# EAGLE schematic DAq2017 (EAGLE 7.4.0)
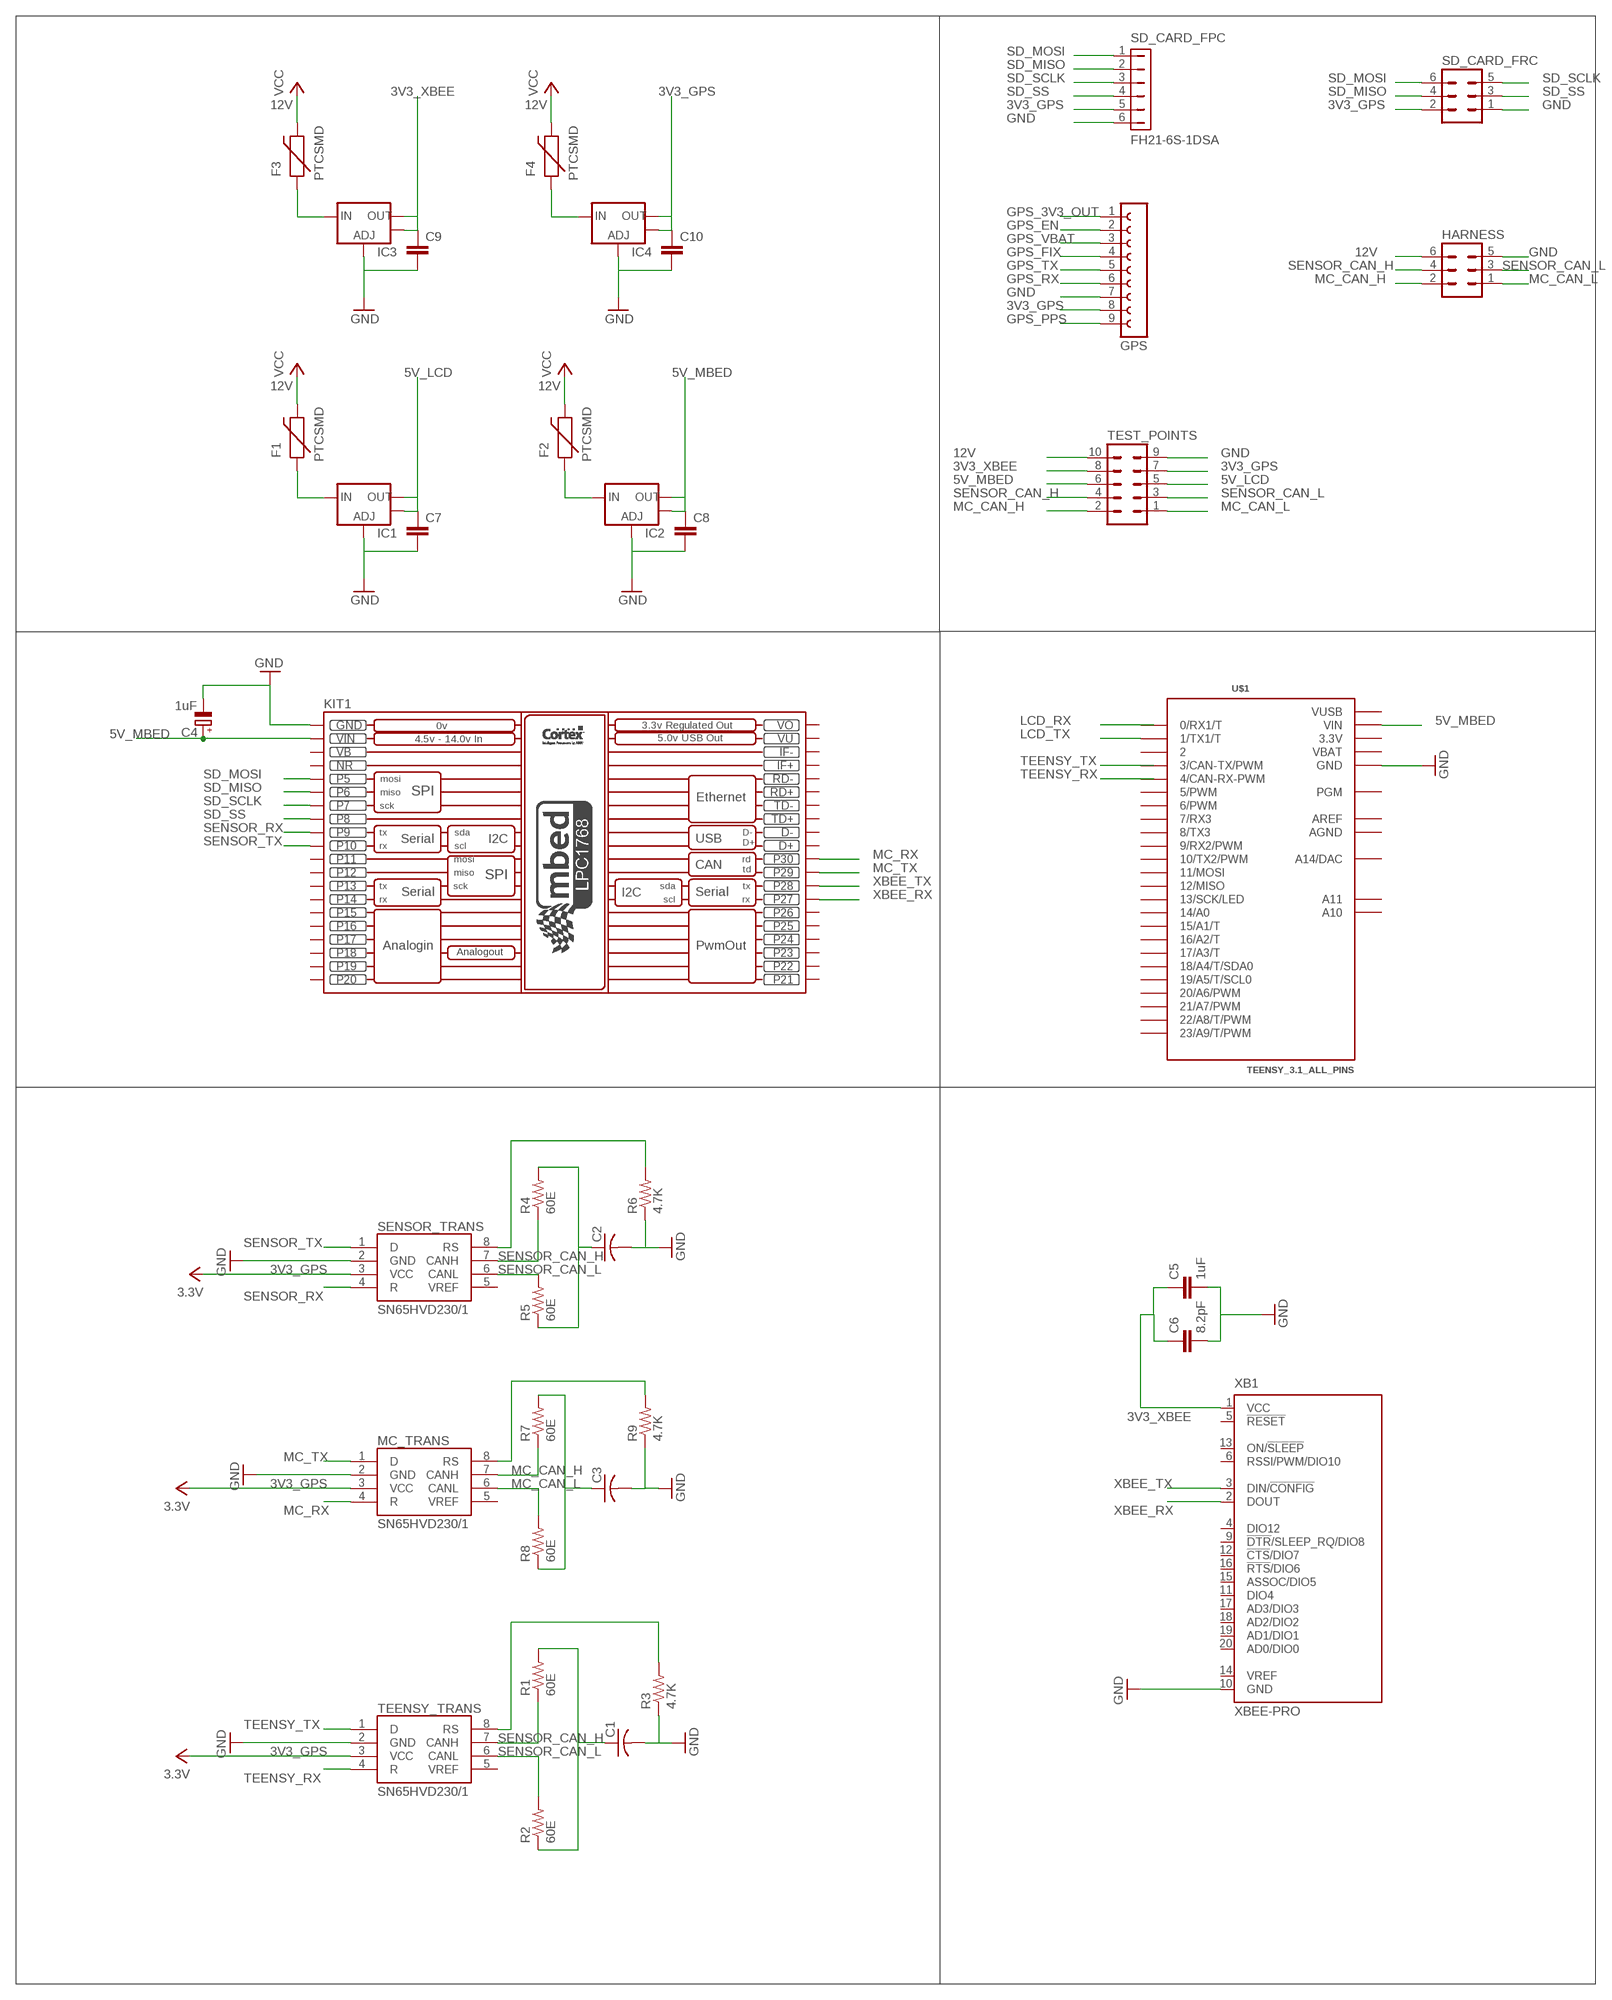
[diagram p0: schematic, sheet 1]

## Parts
C1  C-USC0805  [C0805]
C2  C-USC0805  [C0805]
C3  C-USC0805  [C0805]
C4  1uF  CPOL-EU085CS-1AR  [085CS_1AR]
C5  1uF  C-EU025-024X044  [C025-024X044]
C6  8.2pF  C-EU025-024X044  [C025-024X044]
C7  C-EUC0805  [C0805]
C8  C-EUC0805  [C0805]
C9  C-EUC0805  [C0805]
C10  C-EUC0805  [C0805]
F1  PTCSMD  [PTC-1206]
F2  PTCSMD  [PTC-1206]
F3  PTCSMD  [PTC-1206]
F4  PTCSMD  [PTC-1206]
GPS  FE09-1  [FE09]
HARNESS  MA03-2  [MA03-2]
IC1  V_REG_LM1117SOT223  [SOT223]
IC2  V_REG_LM1117SOT223  [SOT223]
IC3  V_REG_LM1117SOT223  [SOT223]
IC4  V_REG_LM1117SOT223  [SOT223]
KIT1  MBED_NXP_LPC1768  [MBED-KIT]
MC_TRANS  SN65HVD230/1  [SO8]
R1  60E  R-US_R0805  [R0805]
R2  60E  R-US_R0805  [R0805]
R3  4.7K  R-US_R0805  [R0805]
R4  60E  R-US_R0805  [R0805]
R5  60E  R-US_R0805  [R0805]
R6  4.7K  R-US_R0805  [R0805]
R7  60E  R-US_R0805  [R0805]
R8  60E  R-US_R0805  [R0805]
R9  4.7K  R-US_R0805  [R0805]
SD_CARD_FPC  FH21-6S-1DSA  [FH21-6S-1DSA]
SD_CARD_FRC  06V  [06V]
SENSOR_TRANS  SN65HVD230/1  [SO8]
TEENSY_TRANS  SN65HVD230/1  [SO8]
TEST_POINTS  MA05-2  [MA05-2]
U$1  TEENSY_3.1_ALL_PINS  [TEENSY3-ALL_PINS]
XB1  XBEE-PRO  [XBEE-PRO]

## Nets
3V3_GPS: C10.1 GPS.8 IC4.2(OUT) IC4.4(OUT) MC_TRANS.3(VCC) SD_CARD_FPC.5 SD_CARD_FRC.2 SENSOR_TRANS.3(VCC) TEENSY_TRANS.3(VCC) TEST_POINTS.7 ; supply symbol labelled 3.3V
3V3_XBEE: C5.1 C6.1 C9.1 IC3.2(OUT) IC3.4(OUT) TEST_POINTS.8 XB1.1(VCC)
5V_LCD: C7.1 IC1.2(OUT) IC1.4(OUT) TEST_POINTS.5
5V_MBED: C4.+ C8.1 IC2.2(OUT) IC2.4(OUT) KIT1.VIN TEST_POINTS.6 U$1.VIN
12V: F1.2 F2.2 F3.2 F4.2 HARNESS.6 TEST_POINTS.10 ; supply symbol labelled VCC
GND: C1.2 C2.2 C3.2 C4.- C5.2 C6.2 C7.2 C8.2 C9.2 C10.2 GPS.7 HARNESS.5 IC1.1(ADJ) IC2.1(ADJ) IC3.1(ADJ) IC4.1(ADJ) KIT1.GND MC_TRANS.2(GND) R3.1 R6.1 R9.1 SD_CARD_FPC.6 SD_CARD_FRC.1 SENSOR_TRANS.2(GND) TEENSY_TRANS.2(GND) TEST_POINTS.9 U$1.GND U$1.GND1(GND) XB1.10(GND)
GPS_3V3_OUT: GPS.1
GPS_EN: GPS.2
GPS_FIX: GPS.4
GPS_PPS: GPS.9
GPS_RX: GPS.6
GPS_TX: GPS.5
GPS_VBAT: GPS.3
LCD_TX: U$1.1(1/TX1/T)
MC_CAN_H: HARNESS.2 MC_TRANS.7(CANH) R7.1 TEST_POINTS.2
MC_CAN_L: HARNESS.1 MC_TRANS.6(CANL) R8.2 TEST_POINTS.1
MC_RX: KIT1.P$30(P30) MC_TRANS.4(R)
MC_TX: KIT1.P$29(P29) MC_TRANS.1(D)
N$3: C1.1 R1.2 R2.1
N$4: R3.2 TEENSY_TRANS.8(RS)
N$7: C2.1 R4.2 R5.1
N$8: R6.2 SENSOR_TRANS.8(RS)
N$11: C3.1 R7.2 R8.1
N$12: MC_TRANS.8(RS) R9.2
N$14: F1.1 IC1.3(IN)
N$19: F2.1 IC2.3(IN)
N$24: F3.1 IC3.3(IN)
N$28: F4.1 IC4.3(IN)
SD_MISO: KIT1.P$6(P6) SD_CARD_FPC.2 SD_CARD_FRC.4
SD_MOSI: KIT1.P$5(P5) SD_CARD_FPC.1 SD_CARD_FRC.6
SD_SCLK: KIT1.P$7(P7) SD_CARD_FPC.3 SD_CARD_FRC.5
SD_SS: KIT1.P$8(P8) SD_CARD_FPC.4 SD_CARD_FRC.3
SENSOR_CAN_H: HARNESS.4 R1.1 R4.1 SENSOR_TRANS.7(CANH) TEENSY_TRANS.7(CANH) TEST_POINTS.4
SENSOR_CAN_L: HARNESS.3 R2.2 R5.2 SENSOR_TRANS.6(CANL) TEENSY_TRANS.6(CANL) TEST_POINTS.3
SENSOR_RX: KIT1.P$9(P9) SENSOR_TRANS.4(R)
SENSOR_TX: KIT1.P$10(P10) SENSOR_TRANS.1(D)
TEENSY_RX: TEENSY_TRANS.4(R)
TEENSY_TX: TEENSY_TRANS.1(D)
XBEE_RX: KIT1.P$27(P27) XB1.2(DOUT)
XBEE_TX: KIT1.P$28(P28) XB1.3(DIN/!CONFIG)
Unconnected: KIT1.D+ KIT1.D- KIT1.IF+ KIT1.IF- KIT1.P$11(P11) KIT1.P$12(P12) KIT1.P$13(P13) KIT1.P$14(P14) KIT1.P$15(P15) KIT1.P$16(P16) KIT1.P$17(P17) KIT1.P$18(P18) KIT1.P$19(P19) KIT1.P$20(P20) KIT1.P$21(P21) KIT1.P$22(P22) KIT1.P$23(P23) KIT1.P$24(P24) KIT1.P$25(P25) KIT1.P$26(P26) KIT1.RD+ KIT1.RD- KIT1.TD+ KIT1.TD- MC_TRANS.5(VREF) SENSOR_TRANS.5(VREF) TEENSY_TRANS.5(VREF) U$1.0(0/RX1/T) U$1.2 U$1.3(3/CAN-TX/PWM) U$1.4(4/CAN-RX-PWM) U$1.5(5/PWM) U$1.6(6/PWM) U$1.7(7/RX3) U$1.8(8/TX3) U$1.9(9/RX2/PWM) U$1.10(10/TX2/PWM) U$1.11(11/MOSI) U$1.12(12/MISO) U$1.13(13/SCK/LED) U$1.14/A0 U$1.15/A1(15/A1/T) U$1.16/A2(16/A2/T) U$1.17/A3(17/A3/T) U$1.18/A4(18/A4/T/SDA0) U$1.19/A5(19/A5/T/SCL0) U$1.20/A6(20/A6/PWM) U$1.21/A7(21/A7/PWM) U$1.22/A8(22/A8/T/PWM) U$1.23/A9(23/A9/T/PWM) U$1.A10 U$1.A11 U$1.PGM U$1.RESET/DAC(A14/DAC) XB1.4(DIO12) XB1.5(!RESET) XB1.6(RSSI/PWM/DIO10) XB1.9(!DTR!/SLEEP_RQ/DIO8) XB1.11(DIO4) XB1.12(!CTS!/DIO7) XB1.13(ON/!SLEEP) XB1.14(VREF) XB1.15(ASSOC/DIO5) XB1.16(!RTS!/DIO6) XB1.17(AD3/DIO3) XB1.18(AD2/DIO2) XB1.19(AD1/DIO1) XB1.20(AD0/DIO0)

## Power pins joined to a net without a drawn wire
3.3V: U$1.3.3V U$1.3.3V1(3.3V)
AGND: U$1.AGND
AREF: U$1.AREF
NR: KIT1.NR
VB: KIT1.VB
VBAT: U$1.VBAT
VO: KIT1.VOUT(VO)
VU: KIT1.VU
VUSB: U$1.VUSB

## Library data of the parts
C1-C3 = resistor:C-US: CAPACITOR, American symbol
C4 = resistor:CPOL-EU: POLARIZED CAPACITOR, European symbol
C5 C6 = resistor:C-EU: CAPACITOR, European symbol
C7-C10 = Ediff+DAQ_v2:C-EU: CAPACITOR, European symbol
F1-F4 = Ediff+DAQ_v2:PTC: Resettable Fuse PTC Resettable Fuse. Spark Fun Electronics SKU : COM-08357
GPS = con-lsta:FE09-1: FEMALE HEADER; OC_FARNELL: unknown; OC_NEWARK: unknown
HARNESS = con-lstb:MA03-2: PIN HEADER; OC_FARNELL: unknown; OC_NEWARK: unknown
IC1-IC4 = dash:V_REG_LM1117: Voltage Regulator LM1117 Standard adjustable voltage regulator but in SMD form. Spark Fun Electronics SKU : COM-00595
KIT1 = Ediff+DAQ_v2:MBED_NXP_LPC1768: Mbed LPC1768 - ARM CORTEX v2.1 * Schematic symbol is now placed in eagles's default raster. *The pads diameter are suitable for routing between mbed pins * mbed pads are 0.8 mm drill diameter. --------------------------------------------- Created by: Mohamed Yousry *Alexandria, Egypt *Email: mohamed.yousry@ieeegoldegypt.org
MC_TRANS SENSOR_TRANS TEENSY_TRANS = texas_1:SN65HVD230/1
R1-R9 = rcl:R-US_: RESISTOR, American symbol
SD_CARD_FPC = con-hirose:FH21-6S-1DSA: FPC CONNECTOR Source: con-hirose.lbr from Bob Starr <rtzaudio@mindspring.com>; OC_FARNELL: unknown; OC_NEWARK: unknown
SD_CARD_FRC = con-harting-v:06V: CONNECTOR; OC_FARNELL: unknown; OC_NEWARK: unknown
TEST_POINTS = con-lstb:MA05-2: PIN HEADER; OC_FARNELL: unknown; OC_NEWARK: unknown
U$1 = dash:TEENSY_3.1_ALL_PINS: Footprint for Teensy 3.1 or 3.2 board using all through-holes, i.e. the entire perimeter plus the 4 through-holes inboard (A10,A11,AREF, VUSB)
XB1 = Ediff+DAQ_v2:XBEE: XBee (TM) /XBee-PRO(TM) OEM RF Modules Source: MaxStream, Inc. xbee_productmanual.pdf; MPN: XBP24-AWI-001; OC_FARNELL: 1337916; OC_NEWARK: 42M2667